# EAGLE design loop-rs232o (EAGLE 6.6.0)
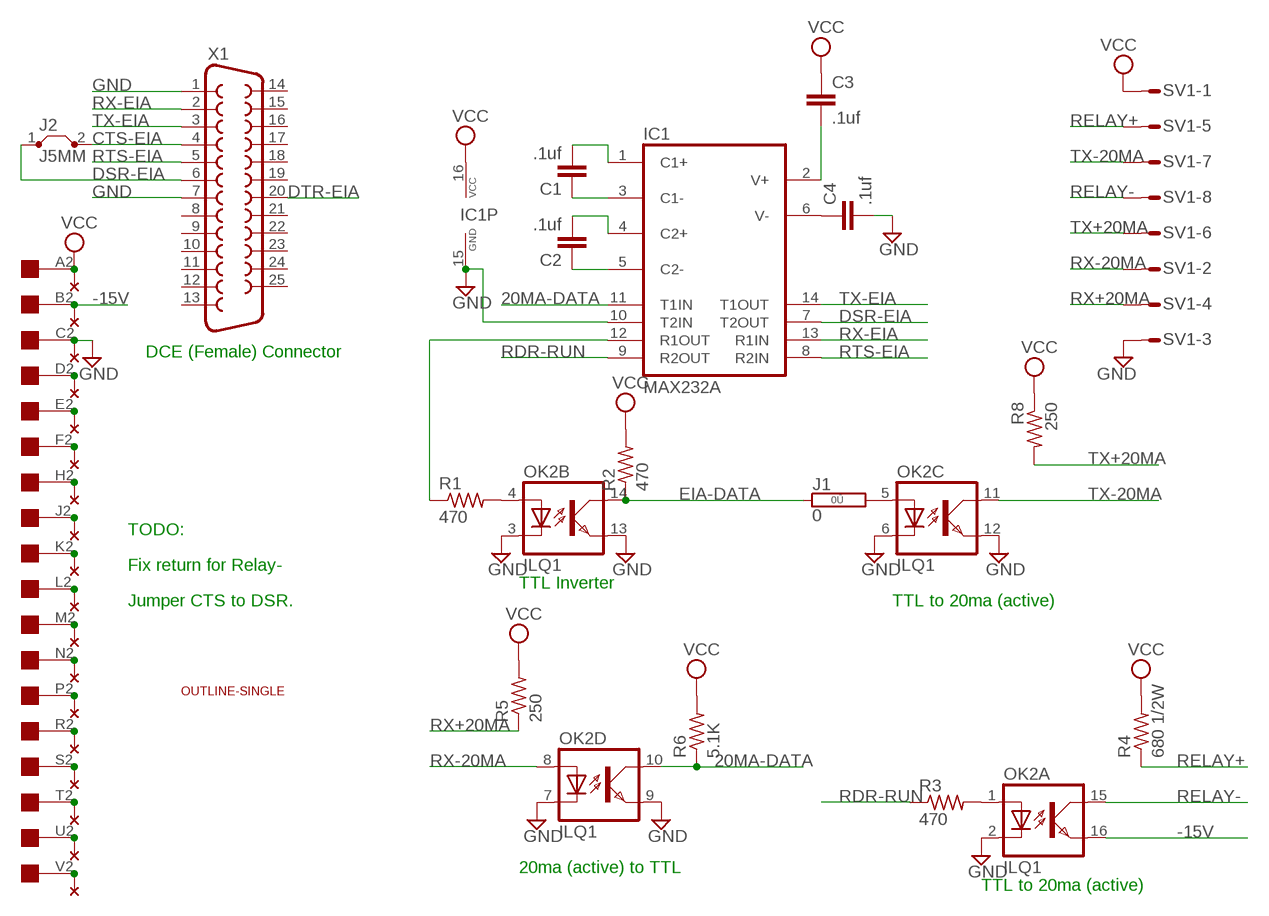
[diagram p0: schematic, sheet 1]

## Parts
C1  .1uf  C-EU050-025X075  [C050-025X075]
C2  .1uf  C-EU050-025X075  [C050-025X075]
C3  .1uf  C-EU050-025X075  [C050-025X075]
C4  .1uf  C-EU050-025X075  [C050-025X075]
IC1  MAX232A  MAX232  [DIL16]
J1  0  0R  [0R/10]
J2  J5MM  [05]
OK2  ILQ1  [DIL16]
R1  470  R-US_0207/10  [0207/10]
R2  470  R-US_0207/10  [0207/10]
R3  470  R-US_0207/10  [0207/10]
R4  680 1/2W  R-US_0207/10  [0207/10]
R5  250  R-US_0207/10  [0207/10]
R6  5.1K  R-US_0207/10  [0207/10]
R8  250  R-US_0207/10  [0207/10]
SV1  S08P  [S08P]
U$2  THRU-HOLE1  [THRU-HOLE1]
U$3  OUTLINE-SINGLE  [SINGLE]
U$4  EDGE-1  [EDGE-CON1]
X1  F25H  [F25H]

## Nets
20MA-DATA: IC1.11(T1IN) OK2.10(D:COL) R6.1
-15V: OK2.16(A:EMIT) U$2.B2 U$4.B2
CTS-EIA: J2.2 X1.4
DSR-EIA: IC1.7(T2OUT) J2.1 X1.6
DTR-EIA: X1.20
EIA-DATA: J1.1 OK2.14(B:COL) R2.1
GND: C4.2 IC1.10(T2IN) IC1.15(GND) OK2.2(A:C) OK2.3(B:C) OK2.6(C:C) OK2.7(D:C) OK2.9(D:EMIT) OK2.12(C:EMIT) OK2.13(B:EMIT) SV1.3 U$2.C2 U$4.C2 X1.1 X1.7
N$1: C2.1 IC1.5(C2-)
N$2: C2.2 IC1.4(C2+)
N$3: C1.2 IC1.1(C1+)
N$4: C1.1 IC1.3(C1-)
N$5: U$2.V2 U$4.V2
N$6: U$2.U2 U$4.U2
N$7: U$2.T2 U$4.T2
N$8: IC1.12(R1OUT) R1.1
N$9: C3.2 IC1.2(V+)
N$10: C4.1 IC1.6(V-)
N$11: OK2.4(B:A) R1.2
N$12: OK2.1(A:A) R3.2
N$13: U$2.S2 U$4.S2
N$14: U$2.R2 U$4.R2
N$15: J1.2 OK2.5(C:A)
N$16: U$2.P2 U$4.P2
N$17: U$2.N2 U$4.N2
N$18: U$2.M2 U$4.M2
N$19: U$2.L2 U$4.L2
N$20: U$2.K2 U$4.K2
N$21: U$2.J2 U$4.J2
N$22: U$2.H2 U$4.H2
N$23: U$2.F2 U$4.F2
N$24: U$2.E2 U$4.E2
N$25: U$2.D2 U$4.D2
RDR-RUN: IC1.9(R2OUT) R3.1
RELAY+: R4.1 SV1.5
RELAY-: OK2.15(A:COL) SV1.8
RTS-EIA: IC1.8(R2IN) X1.5
RX+20MA: R5.1 SV1.4
RX-20MA: OK2.8(D:A) SV1.2
RX-EIA: IC1.13(R1IN) X1.2
TX+20MA: R8.2 SV1.6
TX-20MA: OK2.11(C:COL) SV1.7
TX-EIA: IC1.14(T1OUT) X1.3
VCC: C3.1 IC1.16(VCC) R2.2 R4.2 R5.2 R6.2 R8.1 SV1.1 U$2.A2 U$4.A2
Unconnected: X1.8 X1.9 X1.10 X1.11 X1.12 X1.13 X1.14 X1.15 X1.16 X1.17 X1.18 X1.19 X1.21 X1.22 X1.23 X1.24 X1.25

## Notes on the sheet
- DCE (Female) Connector
- TODO:
- Fix return for Relay-
- TTL Inverter
- Jumper CTS to DSR. | TTL to 20ma (active)
- 20ma (active) to TTL
- TTL to 20ma (active)

## Library data of the parts
C1-C4 = rcl:C-EU: CAPACITOR, European symbol
IC1 = maxim:MAX232: RS232 TRANSCEIVER; MF: MAXIM; MPN: MAX232ACPE+; OC_FARNELL: 9723773; OC_NEWARK: 68K4544
J1 = jumper:0R: Bridge 0R 10mm
J2 = jumper:J: Bridge
OK2 = optocoupler:ILQ1: SIEMENS OPTO COUPLER; MF: VISHAY/TELEFUNKEN; MPN: ILQ1; OC_FARNELL: 1469501; OC_NEWARK: 88K1954
R1-R6 R8 = rcl:R-US_: RESISTOR, American symbol
SV1 = con-amp-mt:S08P: AMP MT CONNECTOR; OC_FARNELL: unknown; OC_NEWARK: unknown
U$2 = dec-con:THRU-HOLE1: Thru-Hole addition to double-sided edge connector.
U$3 = dec-con:OUTLINE-*: Board outlines for DEC boards.
U$4 = dec-con:EDGE-1: Single-Sided DEC Edge Connector -- (side 2)
X1 = con-subd:F25: SUB-D; OC_FARNELL: unknown; OC_NEWARK: unknown

## Board
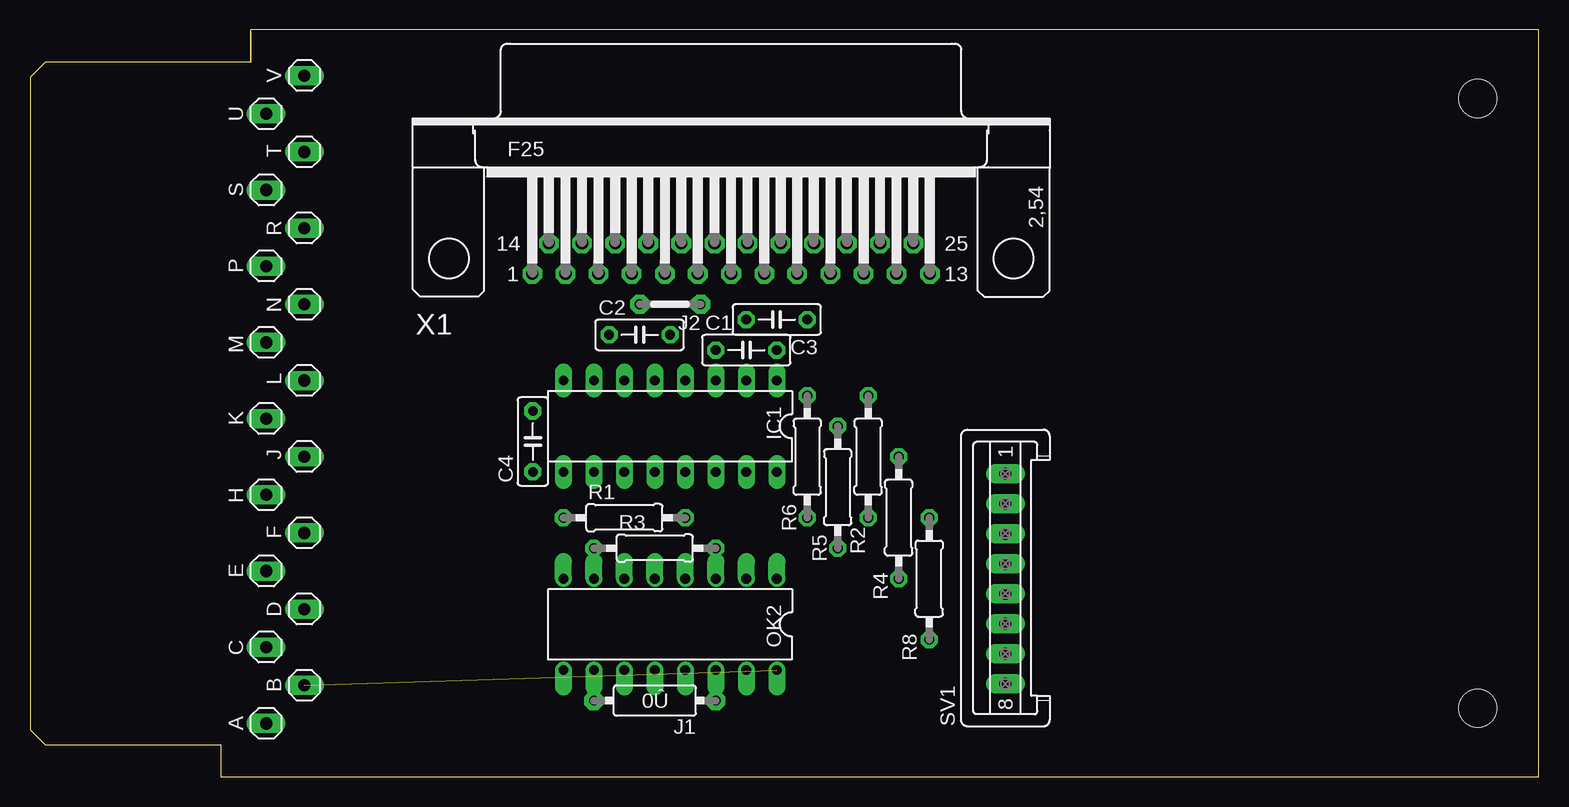
[diagram p1: board, top side]
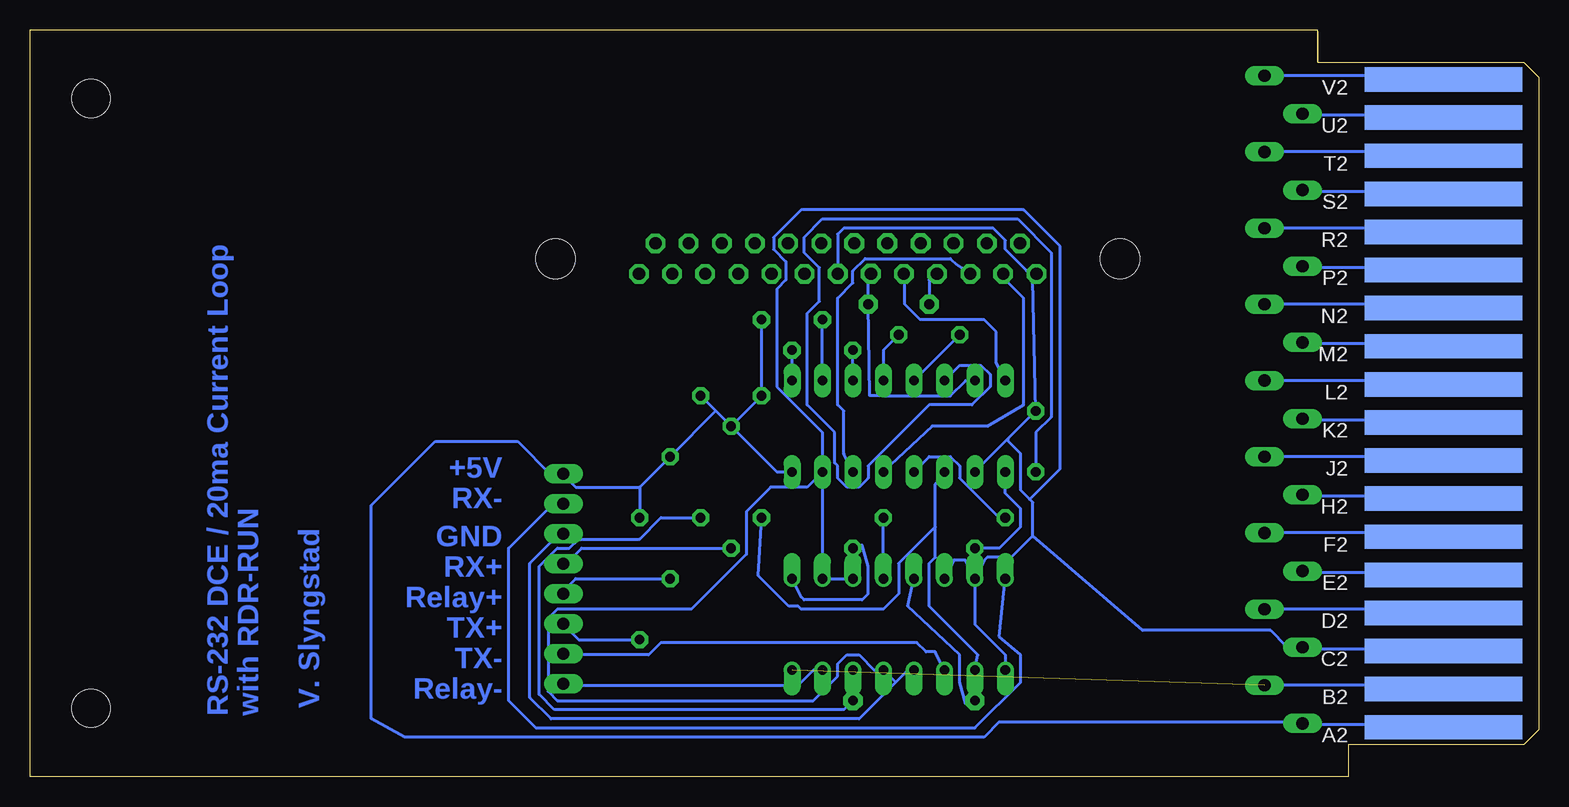
[diagram p2: board, bottom side, seen from below]

Size 125.73 x 62.23 mm. Coordinates in mm from the lower left corner, seen from the top.
Copper layers (1*16): Top 0.035mm / dielectric 1.5mm / Bottom 0.035mm
Design rules "10mils *": minimum track width 10mil, minimum drill 28mil, track to track 15mil, track to pad 10mil, pad to pad 10mil, via to via 10mil, smd to smd 10mil, copper to edge 15mil, drill to drill 10mil, minimum pad ring 12mil, minimum via ring 8mil, stop-mask expansion 0mil, vias tented up to drill 0mil, thermal gap 10mil

### Footprints (pad centres in the part's own frame; a part is rotated, then mirrored left to right if it is on the bottom)
C050-025X075 = drill 0.813 octagon: 1 -2.54,0; 2 2.54,0
DIL16 = drill 0.813 long: 1 -8.89,-3.81; 2 -6.35,-3.81; 3 -3.81,-3.81; 4 -1.27,-3.81; 5 1.27,-3.81; 6 3.81,-3.81; 7 6.35,-3.81; 8 8.89,-3.81; 9 8.89,3.81; 10 6.35,3.81; 11 3.81,3.81; 12 1.27,3.81; 13 -1.27,3.81; 14 -3.81,3.81; 15 -6.35,3.81; 16 -8.89,3.81
0R/10 = drill 0.813 pad 1.6 octagon: 1 -5.08,0; 2 5.08,0
05 = drill 0.813 pad 1.6 octagon: 1 -2.54,0; 2 2.54,0
DIL16' = drill 0.813 offset: 1 -8.89,-3.81; 2 -6.35,-3.81; 3 -3.81,-3.81; 4 -1.27,-3.81; 5 1.27,-3.81; 6 3.81,-3.81; 7 6.35,-3.81; 8 8.89,-3.81; 9 8.89,3.81; 10 6.35,3.81; 11 3.81,3.81; 12 1.27,3.81; 13 -1.27,3.81; 14 -3.81,3.81; 15 -6.35,3.81; 16 -8.89,3.81
0207/10 = drill 0.813 octagon: 1 -5.08,0; 2 5.08,0
S08P = drill 1.016 long: 1 8.75,0; 2 6.25,0; 3 3.75,0; 4 1.25,0; 5 -1.25,0; 6 -3.75,0; 7 -6.25,0; 8 -8.75,0
THRU-HOLE1 = drill 1.016 long: A2 28.575,3.175; B2 25.4,6.35; C2 22.225,3.175; D2 19.05,6.35; E2 15.875,3.175; F2 12.7,6.35; H2 9.525,3.175; J2 6.35,6.35; K2 3.175,3.175; L2 0,6.35; M2 -3.175,3.175; N2 -6.35,6.35; P2 -9.525,3.175; R2 -12.7,6.35; S2 -15.875,3.175; T2 -19.05,6.35; U2 -22.225,3.175; V2 -25.4,6.35
SINGLE = hole 3.175: 120.65,56.515; 120.65,5.715
EDGE-CON1 = smd 13.106 x 2.032 bottom: A2 7.938,4.128; B2 7.938,7.303; C2 7.938,10.477; D2 7.938,13.652; E2 7.938,16.828; F2 7.938,20.003; H2 7.938,23.177; J2 7.938,26.352; K2 7.938,29.527; L2 7.938,32.703; M2 7.938,35.877; N2 7.938,39.053; P2 7.938,42.227; R2 7.938,45.403; S2 7.938,48.578; T2 7.938,51.752; U2 7.938,54.928; V2 7.938,58.102
F25H = drill 1.016 octagon: 1 -16.561,-1.27; 2 -13.792,-1.27; 3 -11.049,-1.27; 4 -8.28,-1.27; 5 -5.512,-1.27; 8 2.769,-1.27; 9 5.512,-1.27; 10 8.28,-1.27; 11 11.049,-1.27; 12 13.792,-1.27; 13 16.561,-1.27; 14 -15.189,1.27; 15 -12.421,1.27; 16 -9.652,1.27; 20 1.372,1.27; 21 4.14,1.27; 22 6.909,1.27; 23 9.652,1.27; 24 12.421,1.27; 25 15.189,1.27 | drill 1.016 pad 1.67 octagon: 6 -2.769,-1.27; 7 0,-1.27; 17 -6.909,1.27; 18 -4.14,1.27; 19 -1.372,1.27 | hole 3.302: -23.52,0; 23.52,0

### Placement (x,y rotation side)
C1  59.69,35.56 0 top
C2  50.8,36.83 0 top
C3  62.23,38.1 180 top
C4  41.91,27.94 90 top
IC1  53.34,29.21 180 top
J1  52.07,6.35 180 top
J2  53.34,39.37 180 top
OK2  ILQ1  [DIL16']  53.34,12.7 180 top
R1  49.53,21.59 0 top
R2  69.85,26.67 90 top
R3  52.07,19.05 0 top
R4  72.39,21.59 90 top
R5  67.31,24.13 90 top
R6  64.77,26.67 90 top
R8  74.93,16.51 270 top
SV1  81.28,16.51 90 top
U$2  16.51,33.02 270 top
U$3  0,0 0 top
U$4  0,0 0 top
X1  58.42,43.18 0 top

### Tracks (layer width: path | path; a pad name or v marks a point on that pad's centre or on a via)
20MA-DATA
  Bottom 0.254: 50.29,20.83 50.29,18.29 50.8,17.78 50.8,14.22 46.74,10.16 OK2.10 | 50.29,20.83 50.29,24.38 IC1.11 | R6.1 65.02,16.76 62.48,14.22 61.72,14.22 61.47,13.97 54.61,13.97 53.34,15.24 53.34,17.78 50.29,20.83
-15V  (1 unrouted)
  Bottom 0.254: U$2.B2 8.38,7.62 8.13,7.37 U$4.B2
CTS-EIA
  Bottom 0.254: J2.2 50.8,41.4 50.29,41.91 X1.4
DSR-EIA
  Bottom 0.254: X1.6 55.88,41.4 J2.1 55.77,31.75 54.61,31.75 49.02,31.75 47.75,33.02 IC1.7
EIA-DATA
  Bottom 0.254: OK2.14 J1.1 57.91,5.59 82.04,5.59 83.31,6.86 83.31,17.53 81.79,19.05 80.77,19.05 80.01,19.81 74.93,19.81 73.15,21.59 R2.1
GND
  Bottom 0.254: X1.7 58.42,45.21 57.91,45.72 45.47,45.72 44.45,44.7 44.45,43.94 42.67,42.16 X1.1 42.16,41.4 C4.2 44.2,28.19 | OK2.7 47.75,18.03 48.77,18.03 OK2.6 | 42.42,23.11 42.16,22.86 42.16,20.07 | 42.42,23.11 43.18,23.88 43.18,26.92 44.2,27.94 44.2,28.19 | 42.16,20.07 43.94,18.29 45.97,18.29 46.23,18.03 OK2.7 | 42.16,20.07 33.02,12.19 22.35,12.19 21.08,10.92 19.81,10.92 U$2.C2 19.56,10.67 8.13,10.67 U$4.C2 | 53.59,7.87 52.32,9.14 OK2.12 | 53.59,7.87 56.64,4.83 82.3,4.83 84.07,6.6 84.07,17.78 81.79,20.07 81.28,20.07 SV1.3 | IC1.15 59.69,28.7 63.5,32.51 63.5,40.64 62.74,41.4 62.74,42.93 63.75,43.94 63.75,44.96 61.47,47.24 42.93,47.24 39.88,44.2 39.88,25.65 42.42,23.11 | 44.2,28.19 IC1.10 | OK2.9 44.45,10.16 46.99,12.7 OK2.7 | 53.59,7.87 OK2.13 55.37,8.89 56.64,10.16 57.66,10.16 58.42,9.4 58.42,8.38 60.45,6.35 81.79,6.35 82.55,7.11 82.55,13.21 81.79,13.97 70.61,13.97 66.04,18.54 66.04,22.1 64.01,24.13 60.96,24.13 IC1.15 | OK2.3 OK2.2 IC1.15
N$1
  Bottom 0.254: C2.1 IC1.5
N$2
  Bottom 0.254: IC1.4 54.61,35.56 C2.2
N$3
  Bottom 0.254: IC1.1 C1.2
N$4
  Bottom 0.254: IC1.3 C1.1
N$5
  Bottom 0.254: U$2.V2 8.38,58.42 8.13,58.17 U$4.V2
N$6
  Bottom 0.254: 19.81,55.37 U$2.U2 19.56,55.12 8.13,55.12 U$4.U2
N$7
  Bottom 0.254: U$2.T2 8.38,52.07 8.13,51.82 U$4.T2
N$8
  Bottom 0.254: R1.1 44.96,21.59 48.26,24.89 48.26,25.91 49.02,26.67 50.8,26.67 IC1.12
N$9
  Bottom 0.254: IC1.2 C3.2
N$10
  Bottom 0.254: C4.1 41.91,28.7 40.64,29.97 40.64,43.69 43.43,46.48 59.69,46.48 61.21,44.96 61.21,43.69 59.94,42.42 59.94,39.62 60.96,38.61 60.96,30.99 58.67,28.7 58.67,26.16 58.42,25.91 58.42,24.89 57.66,24.13 56.64,24.13 55.88,24.89 55.88,25.91 50.8,30.99 47.24,30.99 45.72,32.51 45.72,33.53 46.48,34.29 48.26,34.29 IC1.6
N$11
  Bottom 0.254: OK2.4 R1.2
N$12
  Bottom 0.254: R3.2 56.39,19.3 55.88,17.53 55.88,15.24 56.39,14.73 61.21,14.73 61.47,14.99 OK2.1
N$13
  Bottom 0.254: 19.81,49.02 U$2.S2 19.56,48.77 8.13,48.77 U$4.S2
N$14
  Bottom 0.254: U$2.R2 8.38,45.72 8.13,45.47 U$4.R2
N$15
  Bottom 0.254: OK2.5 52.58,14.22 48.26,10.16 48.26,7.87 47.75,6.1 J1.2
N$16
  Bottom 0.254: 19.81,42.67 U$2.P2 19.56,42.42 8.13,42.42 U$4.P2
N$17
  Bottom 0.254: U$2.N2 8.38,39.37 8.13,39.12 U$4.N2
N$18
  Bottom 0.254: 19.81,36.32 U$2.M2 19.56,36.07 8.13,36.07 U$4.M2
N$19
  Bottom 0.254: U$2.L2 8.38,33.02 8.13,32.77 U$4.L2
N$20
  Bottom 0.254: 19.81,29.97 U$2.K2 19.56,29.72 8.13,29.72 U$4.K2
N$21
  Bottom 0.254: U$2.J2 8.38,26.67 8.13,26.42 U$4.J2
N$22
  Bottom 0.254: 19.81,23.62 U$2.H2 19.56,23.37 8.13,23.37 U$4.H2
N$23
  Bottom 0.254: U$2.F2 8.38,20.32 8.13,20.07 U$4.F2
N$24
  Bottom 0.254: 19.81,17.27 U$2.E2 19.56,17.02 8.13,17.02 U$4.E2
N$25
  Bottom 0.254: U$2.D2 8.38,13.97 8.13,13.72 U$4.D2
RDR-RUN
  Bottom 0.254: R3.1 44.96,19.05 43.18,20.83 43.18,22.35 44.45,23.62 IC1.9
RELAY+
  Bottom 0.254: R4.1 80.26,16.51 81.28,15.49 SV1.5
RELAY-
  Bottom 0.254: OK2.15 60.45,8.89 61.72,7.62 81.28,7.62 SV1.8
RTS-EIA
  Bottom 0.254: IC1.8 45.21,34.54 45.21,37.08 46.23,38.1 51.56,38.1 52.83,39.37 52.83,41.4 X1.5
RX+20MA
  Bottom 0.254: R5.1 79.76,19.05 81.28,17.53 SV1.4
RX-20MA
  Bottom 0.254: OK2.8 44.96,11.68 43.18,10.16 43.18,7.87 46.99,4.06 83.57,4.06 85.85,6.35 85.85,19.05 82.55,22.35 SV1.2
RX-EIA
  Bottom 0.254: IC1.13 50.55,29.21 45.97,29.21 42.93,30.99 42.93,39.88 44.45,41.4 X1.2
TX+20MA
  Bottom 0.254: R8.2 80.01,11.43 81.28,12.7 SV1.6
TX-20MA
  Bottom 0.254: OK2.11 50.29,10.41 51.05,10.41 51.82,11.18 73.15,11.18 74.17,10.16 80.26,10.16 SV1.7
TX-EIA
  Bottom 0.254: IC1.14 57.91,26.92 57.91,30.48 58.42,30.99 58.42,39.88 57.15,41.15 57.15,42.16 56.13,43.18 49.02,43.18 48.51,42.67 X1.3
VCC
  Bottom 0.254: C3.1 R6.2 R5.2 | U$4.A2 8.13,4.32 19.56,4.32 U$2.A2 19.81,4.57 44.96,4.57 46.23,3.3 94.49,3.3 97.28,4.83 97.28,22.61 91.95,27.94 85.09,27.94 82.3,25.15 SV1.1 81.28,25.15 80.26,24.13 74.93,24.13 | 74.93,24.13 R8.1 | IC1.16 63.5,25.4 R5.2 | R5.2 68.58,30.48 | 68.58,30.48 R2.2 | 68.58,30.48 R4.2 74.93,24.13

### Text on the board
Bottom: +5V | RX- | GND | RX+ | Relay+ | TX+ | TX- | Relay- | V. Slyngstad | with RDR-RUN | RS-232 DCE / 20ma Current Loop